# EAGLE design femto-beacon-esp32pico-d4-lps (EAGLE 9.3.0)

## Sheet 1 of 4
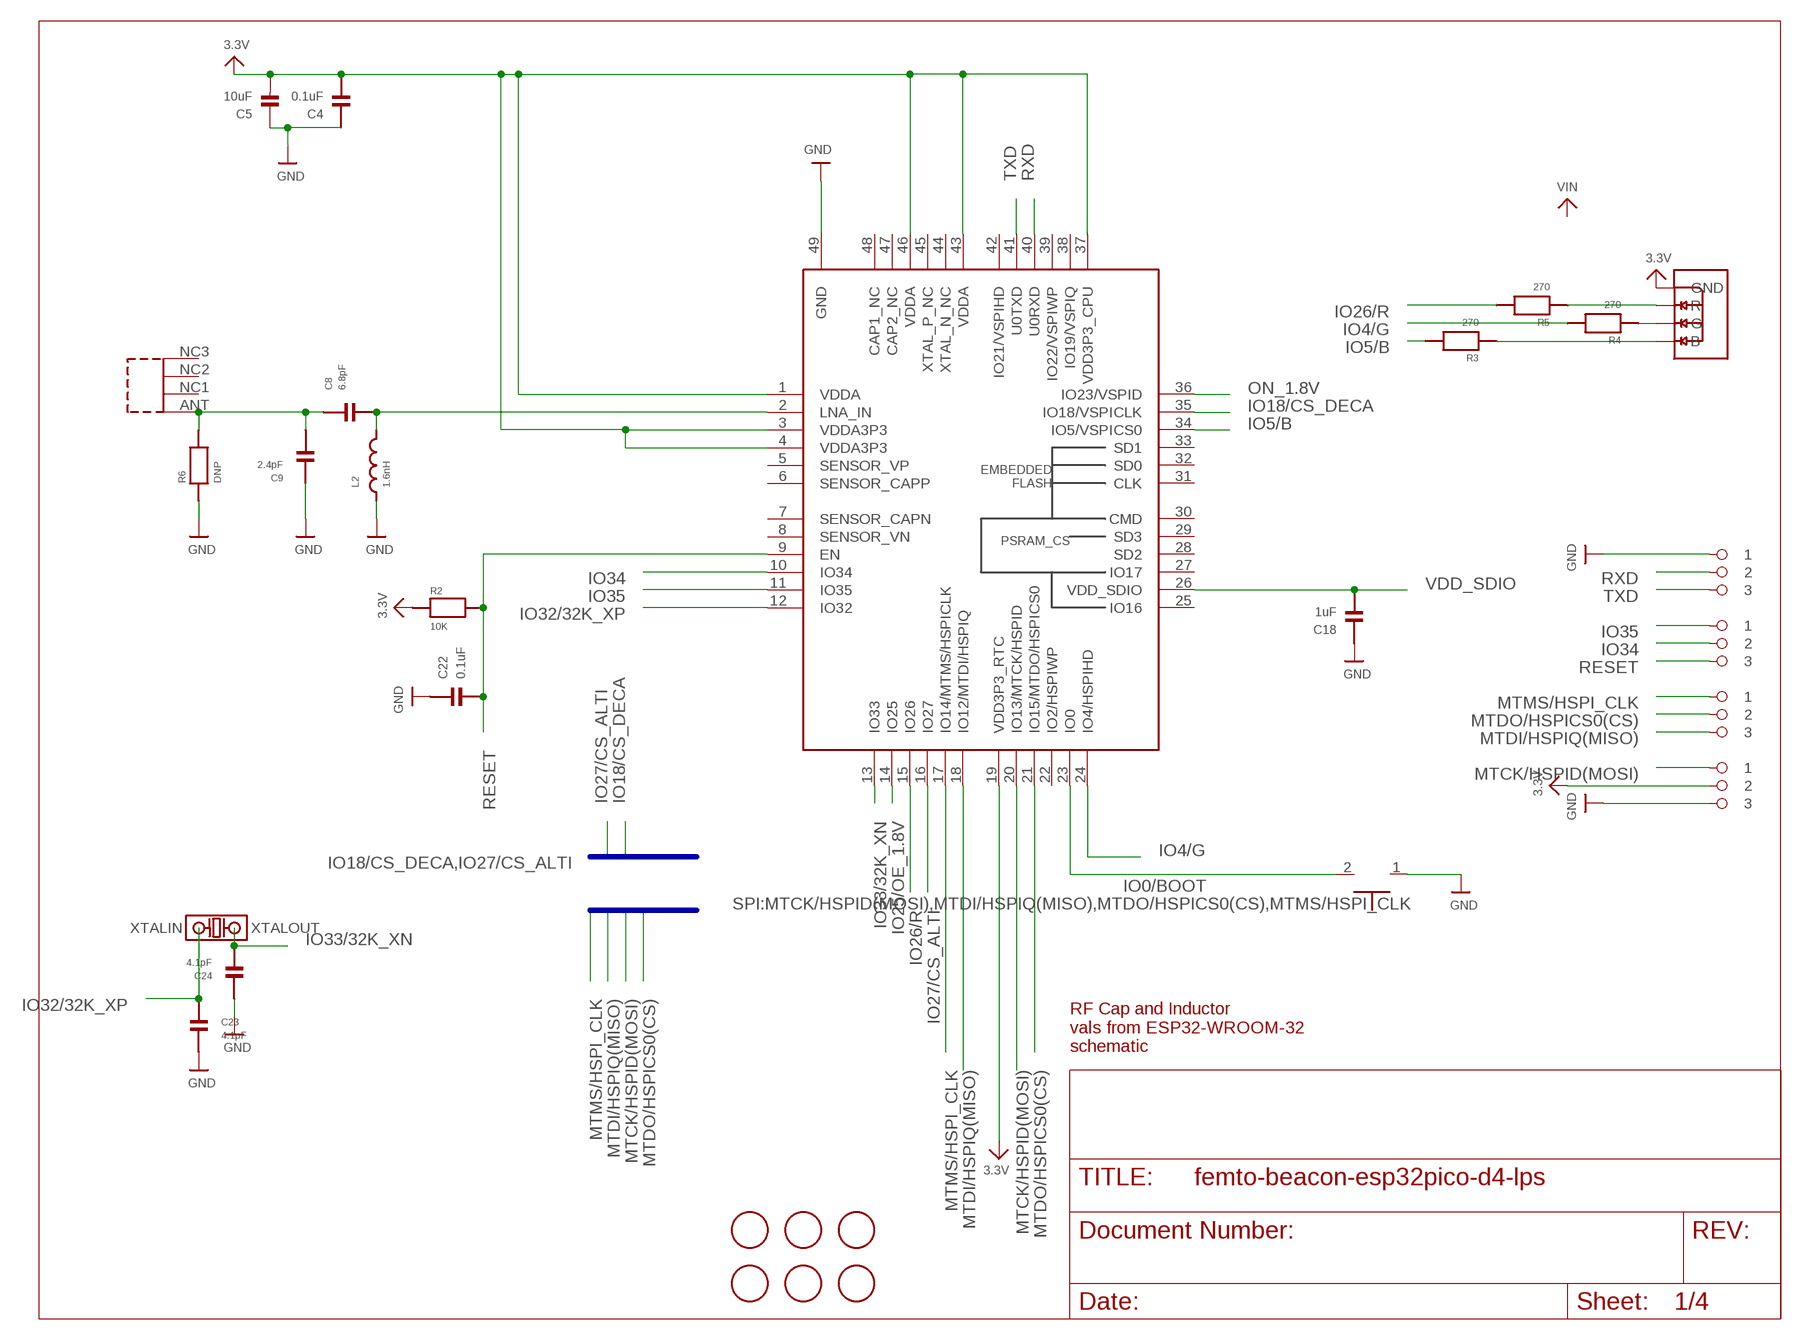
[diagram p0: schematic, sheet 1]

### Parts
ANT1  0479480001  [0479480001]
BOOT1  TACTILE_SWITCH_NO_GND_NO_BOSS  [SIDE_ACT_NO_GND_NO_BOSS]
C4  0.1uF  CAPACITOR_0201  [PART]
C5  10uF  CAP_CERAMIC_0603MP  [_0603MP]
C8  6.8pF  CAPACITOR_0201  [PART]
C9  2.4pF  CAPACITOR_0201  [PART]
C18  1uF  CAPACITOR_0201  [PART]
C22  0.1uF  CAPACITOR_0201  [PART]
C23  4.1pF  CAPACITOR_0201  [PART]
C24  4.1pF  CAPACITOR_0201  [PART]
FID1  FIDUCIAL  [FIDUCIAL_1MM]
FID2  FIDUCIAL  [FIDUCIAL_1MM]
FID3  FIDUCIAL  [FIDUCIAL_1MM]
FID4  FIDUCIAL  [FIDUCIAL_1MM]
FID5  FIDUCIAL  [FIDUCIAL_1MM]
FID6  FIDUCIAL  [FIDUCIAL_1MM]
IC1  ESP32-PICO-D4  [ESP32-QFN48_7X7]
L2  1.6nH  INDUCTOR_FIXED_0201  [PART]
PIN_EN  1X3_ROUND  [1X3_ROUND]
PIN_GPIO_A  1X3_ROUND  [1X3_ROUND]
PIN_GPIO_B  1X3_ROUND  [1X3_ROUND]
PIN_UART  1X3_ROUND  [1X3_ROUND]
R2  10K  RESISTOR_0201  [PART]
R3  270  RESISTOR_0201  [PART]
R4  270  RESISTOR_0201  [PART]
R5  270  RESISTOR_0201  [PART]
R6  DNP  RESISTOR_0201  [PART]
RGB1  LRTB_R48G  [LRTB_R48G]
XTAL2  ABS06-107-32.768KHZ-T  [ABS06-107-32.768KHZ-T]

### Nets
3.3V: C4.2 C5.2 IC1.1(VDDA) IC1.3(VDDA3P3) IC1.4(VDDA3P3) IC1.19(VDD3P3_RTC) IC1.37(VDD3P3_CPU) IC1.43(VDDA) IC1.46(VDDA) PIN_GPIO_A.P$2 R2.1 RGB1.1(GND) ; also sheet 2,3,4
ANT: C8.2 IC1.2(LNA_IN) L2.2
B_: R3.1 RGB1.4(B)
G_: R4.1 RGB1.3(G)
GND: BOOT1.1 C4.1 C5.1 C9.1 C18.1 C22.1 C23.1 C24.2 IC1.49(GND) L2.1 PIN_GPIO_A.P$3 PIN_UART.P$1 R6.1 ; also sheet 2,3,4
IO0/BOOT: BOOT1.2 IC1.23(IO0)
IO4/G: IC1.24(IO4/HSPIHD) R4.2
IO5/B: IC1.34(IO5/VSPICS0) R3.2
IO18/CS_DECA: IC1.35(IO18/VSPICLK) ; also sheet 3,4
IO25/OE_1.8V: IC1.14(IO25) ; also sheet 3
IO26/R: IC1.15(IO26) R5.2
IO27/CS_ALTI: IC1.16(IO27) ; also sheet 3,4
IO32/32K_XP: C23.2 IC1.12(IO32) XTAL2.1(XTALIN)
IO33/32K_XN: C24.1 IC1.13(IO33) XTAL2.2(XTALOUT)
IO34: IC1.10(IO34) PIN_EN.P$2
IO35: IC1.11(IO35) PIN_EN.P$1
MTCK/HSPID(MOSI): IC1.20(IO13/MTCK/HSPID) PIN_GPIO_A.P$1 ; also sheet 3,4
MTDI/HSPIQ(MISO): IC1.18(IO12/MTDI/HSPIQ) PIN_GPIO_B.P$3 ; also sheet 3,4
MTDO/HSPICS0(CS): IC1.21(IO15/MTDO/HSPICS0) PIN_GPIO_B.P$2 ; also sheet 3
MTMS/HSPI_CLK: IC1.17(IO14/MTMS/HSPICLK) PIN_GPIO_B.P$1 ; also sheet 3,4
N$6: ANT1.ANT C8.1 C9.2 R6.2
ON_1.8V: IC1.36(IO23/VSPID) ; also sheet 2
R_: R5.1 RGB1.2(R)
RESET: C22.2 IC1.9(EN) PIN_EN.P$3 R2.2
RXD: IC1.40(U0RXD) PIN_UART.P$2
TXD: IC1.41(U0TXD) PIN_UART.P$3
VDD_SDIO: C18.2 IC1.26(VDD_SDIO)
Unconnected: ANT1.NC1 ANT1.NC2 ANT1.NC3 IC1.5(SENSOR_VP) IC1.6(SENSOR_CAPP) IC1.7(SENSOR_CAPN) IC1.8(SENSOR_VN) IC1.22(IO2/HSPIWP) IC1.25(IO16) IC1.27(IO17) IC1.28(SD2) IC1.29(SD3) IC1.30(CMD) IC1.31(CLK) IC1.32(SD0) IC1.33(SD1) IC1.38(IO19/VSPIQ) IC1.39(IO22/VSPIWP) IC1.42(IO21/VSPIHD) IC1.44(XTAL_N_NC) IC1.45(XTAL_P_NC) IC1.47(CAP2_NC) IC1.48(CAP1_NC)

### Buses
SPI:MTCK/HSPID(MOSI),MTDI/HSPIQ(MISO),MTDO/HSPICS0(CS),MTMS/HSPI_CLK
IO18/CS_DECA,IO27/CS_ALTI

### Notes on the sheet
- RF Cap and Inductor
  vals from ESP32-WROOM-32
  schematic

## Sheet 2 of 4
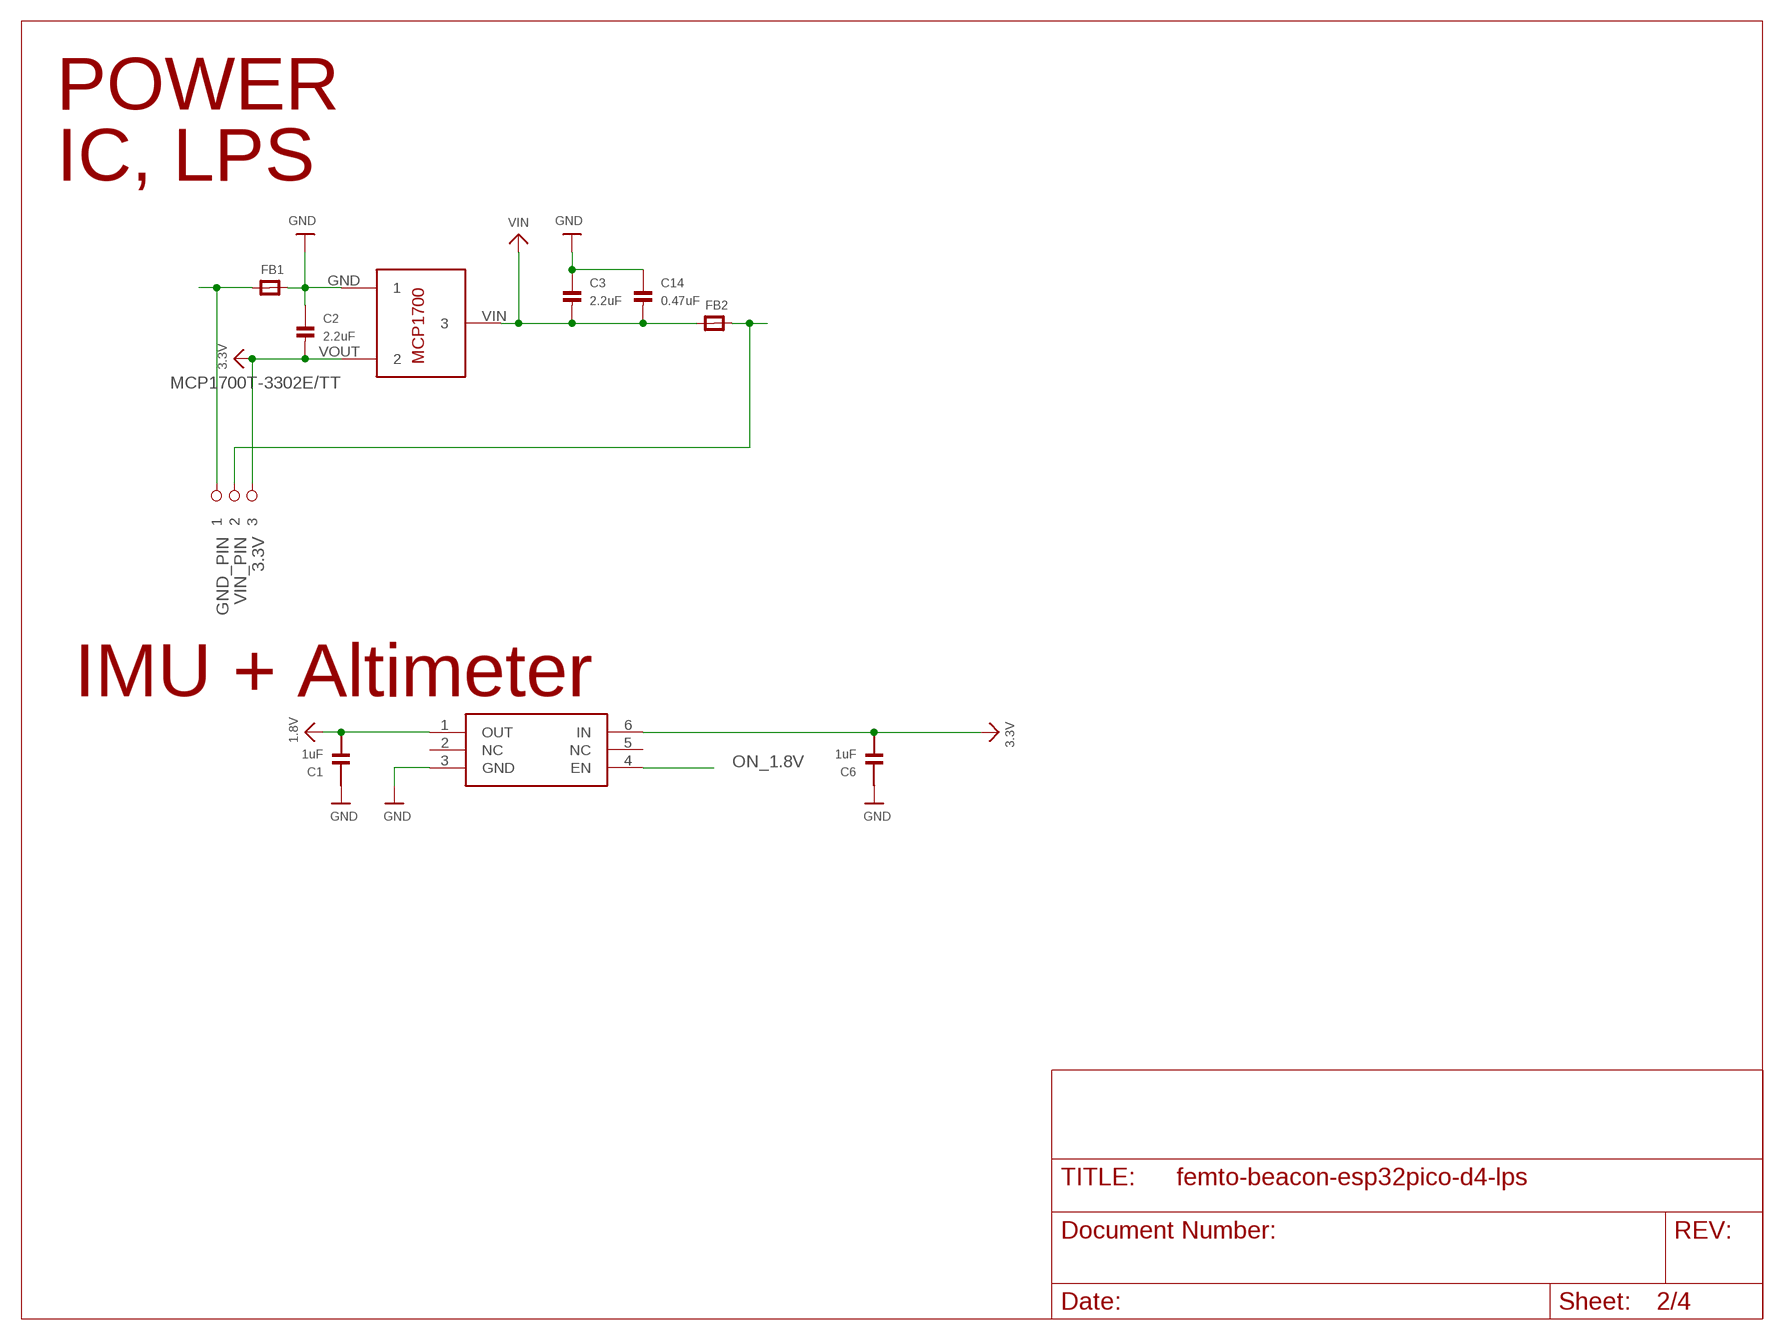
[diagram p1: schematic, sheet 2]

### Parts
C1  1uF  CAPACITOR_0201  [PART]
C2  2.2uF  CAP_CERAMIC_0402MP  [_0402MP]
C3  2.2uF  CAP_CERAMIC_0402MP  [_0402MP]
C6  1uF  CAPACITOR_0201  [PART]
C14  0.47uF  CAP_CERAMIC_0402MP  [_0402MP]
FB1  FERRITE_0603MP  [_0603MP]
FB2  FERRITE_0603MP  [_0603MP]
LDO1  MCP1700T-3302E/TT  [MCP1700T-3302E/TT]
LDO1.8V  NCP705MT18TCG  [CASE_511BR]
PIN_PWR  1X3_ROUND  [1X3_ROUND]

### Nets
1.8V: C1.2 LDO1.8V.1(OUT) ; also sheet 3
3.3V: C2.2 C6.2 LDO1.8V.6(IN) LDO1.VOUT PIN_PWR.P$3 ; also sheet 1,3,4
GND: C1.1 C2.1 C3.1 C6.1 C14.1 FB1.2 LDO1.8V.3(GND) LDO1.GND ; also sheet 1,3,4
GND_PIN: FB1.1 PIN_PWR.P$1
ON_1.8V: LDO1.8V.4(EN) ; also sheet 1
VIN: C3.2 C14.2 FB2.1 LDO1.VIN
VIN_PIN: FB2.2 PIN_PWR.P$2
Unconnected: LDO1.8V.2(NC) LDO1.8V.5(NC)

### Notes on the sheet
- POWER
- IC, LPS
- IMU + Altimeter

## Sheet 3 of 4
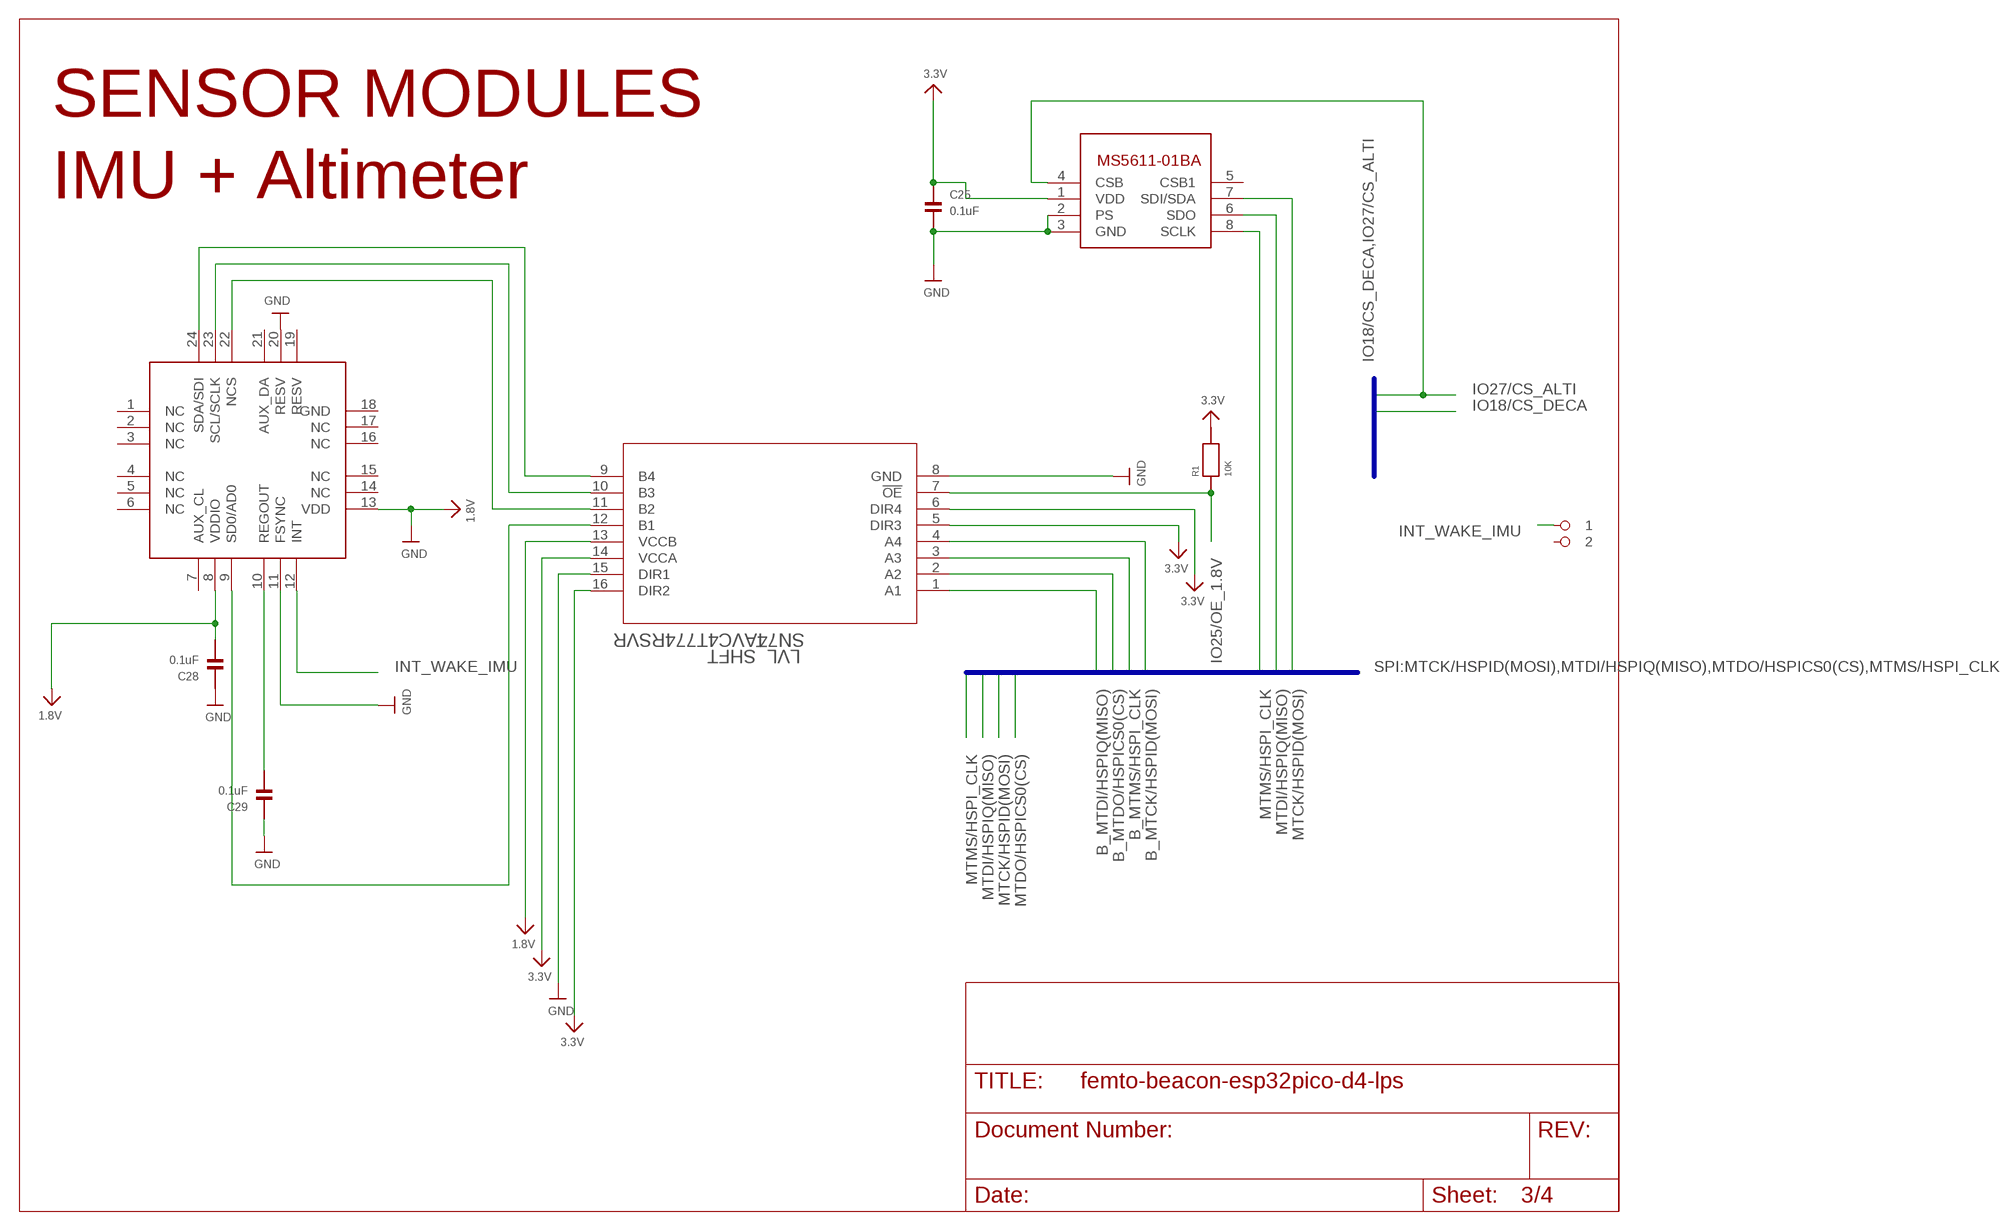
[diagram p2: schematic, sheet 3]

### Parts
ALT1  MS5611-01BA03  [MS5611-01BA03]
C25  0.1uF  CAPACITOR_0201  [PART]
C28  0.1uF  CAPACITOR_0201  [PART]
C29  0.1uF  CAPACITOR_0201  [PART]
IMU1  ICM-20948  [QFN24_3X3]
LVL_SHFT  SN74AVC4T774RSVR  [RSV16]
R1  10K  RESISTOR_0201  [PART]
U$1  1X2_ROUND  [1X2_ROUND]

### Nets
1.8V: C28.2 IMU1.8(VDDIO) IMU1.13(VDD) LVL_SHFT.13(VCCB) ; supply symbol labelled GND ; also sheet 2
3.3V: ALT1.1(VDD) C25.1 LVL_SHFT.5(DIR3) LVL_SHFT.6(DIR4) LVL_SHFT.14(VCCA) LVL_SHFT.16(DIR2) R1.2 ; also sheet 1,2,4
B_MTCK/HSPID(MOSI): IMU1.24(SDA/SDI) LVL_SHFT.9(B4)
B_MTDI/HSPIQ(MISO): IMU1.9(SD0/AD0) LVL_SHFT.12(B1)
B_MTDO/HSPICS0(CS): IMU1.22(NCS) LVL_SHFT.11(B2)
B_MTMS/HSPI_CLK: IMU1.23(SCL/SCLK) LVL_SHFT.10(B3)
GND: ALT1.2(PS) ALT1.3(GND) C25.2 C28.1 C29.1 IMU1.11(FSYNC) IMU1.20(RESV) LVL_SHFT.8(GND) LVL_SHFT.15(DIR1) ; also sheet 1,2,4
INT_WAKE_IMU: IMU1.12(INT) U$1.P$1
IO25/OE_1.8V: LVL_SHFT.7(!OE) R1.1 ; also sheet 1
IO27/CS_ALTI: ALT1.4(CSB) ; also sheet 1,4
MTCK/HSPID(MOSI): ALT1.7(SDI/SDA) LVL_SHFT.4(A4) ; also sheet 1,4
MTDI/HSPIQ(MISO): ALT1.6(SDO) LVL_SHFT.1(A1) ; also sheet 1,4
MTDO/HSPICS0(CS): LVL_SHFT.2(A2) ; also sheet 1
MTMS/HSPI_CLK: ALT1.8(SCLK) LVL_SHFT.3(A3) ; also sheet 1,4
N$16: C29.2 IMU1.10(REGOUT)
Unconnected: ALT1.5(CSB1) IMU1.1(NC) IMU1.2(NC) IMU1.3(NC) IMU1.4(NC) IMU1.5(NC) IMU1.6(NC) IMU1.7(AUX_CL) IMU1.14(NC) IMU1.15(NC) IMU1.16(NC) IMU1.17(NC) IMU1.19(RESV) IMU1.21(AUX_DA) U$1.P$2

### Buses
SPI:MTCK/HSPID(MOSI),MTDI/HSPIQ(MISO),MTDO/HSPICS0(CS),MTMS/HSPI_CLK
IO18/CS_DECA,IO27/CS_ALTI

### Notes on the sheet
- SENSOR MODULES
- IMU + Altimeter

## Sheet 4 of 4
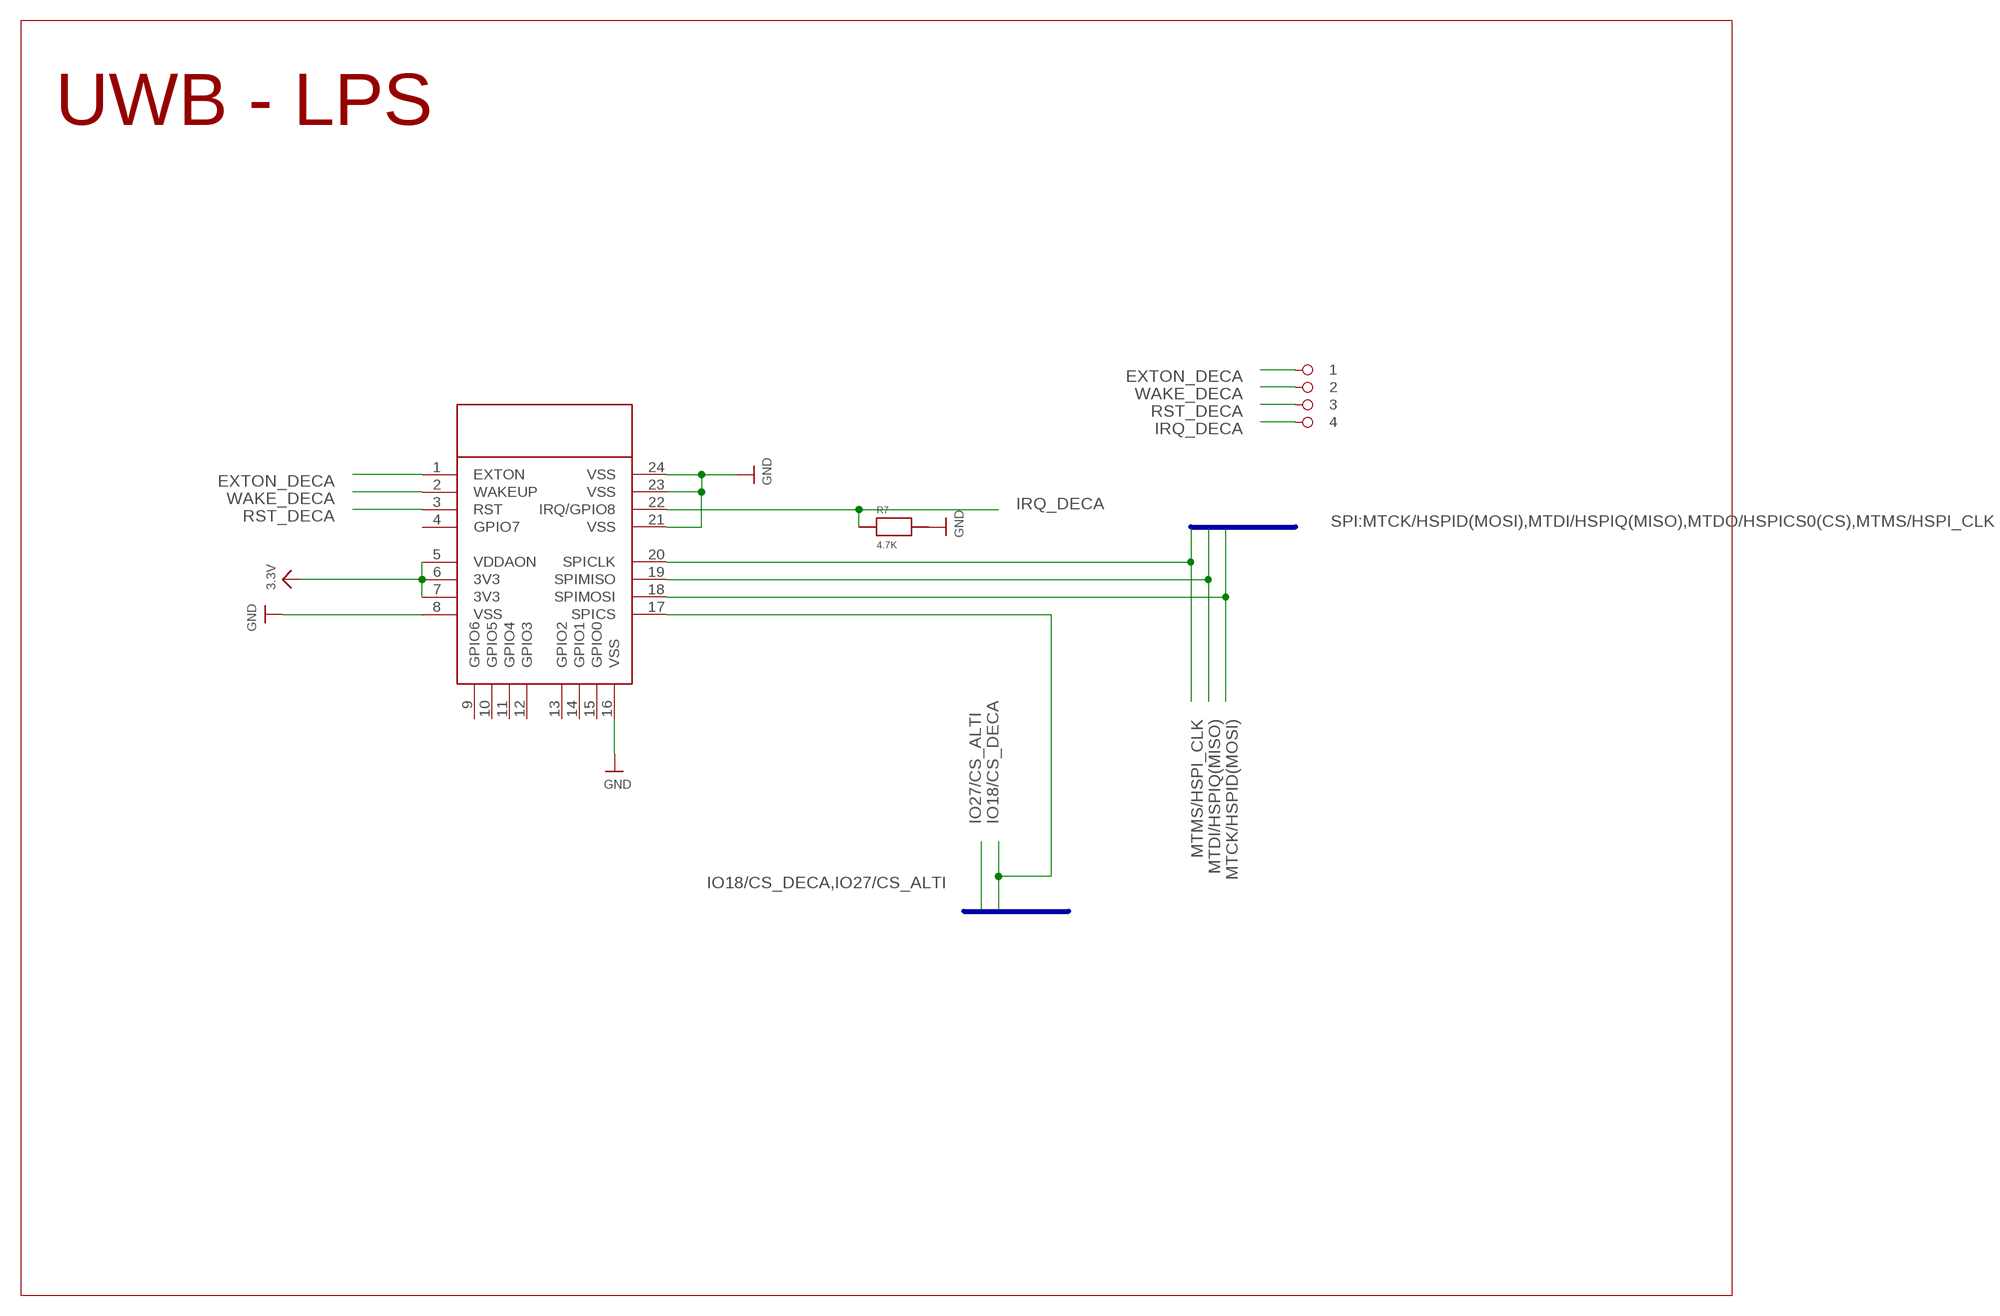
[diagram p3: schematic, sheet 4]

### Parts
LPS1  DWM100  [DWM100_MOD]
R7  4.7K  RESISTOR_0201  [PART]
U$39  1X4_ROUND  [1X4_ROUND]

### Nets
3.3V: LPS1.5(VDDAON) LPS1.6(3V3) LPS1.7(3V3) ; also sheet 1,2,3
EXTON_DECA: LPS1.1(EXTON) U$39.P$1
GND: LPS1.8(VSS) LPS1.16(VSS) LPS1.21(VSS) LPS1.23(VSS) LPS1.24(VSS) R7.2 ; also sheet 1,2,3
IO18/CS_DECA: LPS1.17(SPICS) ; also sheet 1,3
IRQ_DECA: LPS1.22(IRQ/GPIO8) R7.1 U$39.P$4
MTCK/HSPID(MOSI): LPS1.18(SPIMOSI) ; also sheet 1,3
MTDI/HSPIQ(MISO): LPS1.19(SPIMISO) ; also sheet 1,3
MTMS/HSPI_CLK: LPS1.20(SPICLK) ; also sheet 1,3
RST_DECA: LPS1.3(RST) U$39.P$3
WAKE_DECA: LPS1.2(WAKEUP) U$39.P$2
Unconnected: LPS1.4(GPIO7) LPS1.9(GPIO6) LPS1.10(GPIO5) LPS1.11(GPIO4) LPS1.12(GPIO3) LPS1.13(GPIO2) LPS1.14(GPIO1) LPS1.15(GPIO0)

### Buses
SPI:MTCK/HSPID(MOSI),MTDI/HSPIQ(MISO),MTDO/HSPICS0(CS),MTMS/HSPI_CLK
IO18/CS_DECA,IO27/CS_ALTI

### Notes on the sheet
- UWB - LPS

## Power pins joined to a net without a drawn wire
GND: IMU1.18(GND)

## Library data of the parts
ALT1 = freeimu:MS5611-01BA03; MPN: MS561101BA03-50
ANT1 = molex-antenna-2.4GHz:0479480001: Molex 2.4GHz SMD tower antenna.; MPN: 0479480001
BOOT1 = omron_tactile_switch:TACTILE_SWITCH_NO_GND_NO_BOSS: Omron tactile switch; MPN: B3U-3000P
C1 C6 C18 = parts_0201:CAPACITOR_0201; MPN: CL03A105KQ3CSNH
C2 C3 = microbuilder:CAP_CERAMIC: Ceramic Capacitors 0402 - 0402 Surface Mount Capacitors 16pF 50V 5% [Digikey: 445-4899-2-ND] 18pF 50V 5% [Digikey: 490-1281-2-ND] 22pF 50V 5% [Digikey: 490-1283-2-ND] 68pF 50V 5% [Digikey: 490-1289-2-ND] 0.1uF 10V 10% [Digikey: 490-1318-2-ND] 1.0uF 6.3V 10% [Digikey: 490-1320-2-ND] 0603 - 0603 Surface Mount Capacitors 16 pF 50V 5% [Digikey: 445-5051-2-ND] 22 pF 50V [Digikey: PCC220ACVTR-ND] 33 pF 50V 5% [Digikey: 490-1415-1-ND] 56pF 50V 5% [Digikey: 490-1421-1-ND] 220pF 50V 5% [Digikey: 445-1285-1-ND] 680 pF 50V 2200 pF 50V 5% C0G [Digikey: 445-1297-1-ND] 5600 pF 100V 5% X7R [Digikey: 478-3711-1-ND] 0.1 µF 25V 10% [Digikey: PCC2277TR-ND] 0.22 µF 16V 10% X7R [Digikey: 445-1318-1-ND] 1.0 µF 25V 10% [Digikey: 445-5146-2-ND] 0603 - RF Specific 3pF 250V +/-0.1pF RF [Digikey: 712-1347-1-ND] 18 pF 250V 5% [Digikey: 478-3505-1-ND or 712-1322-1-ND] 56 pF 250V 5% C0G RF [Digikey: 490-4867-1-ND] 68 pF 250V RF [Digikey: 490-4868-1-ND] 0805 - 0805 Surface Mount Capacitors 220 pF 250V 2% RF Ceramic Capacitor [Digikey: 712-1398-1-ND] 1000 pF 50V 2% NP0 Ceramic Capacitor [Digikey: 478-3760-1-ND] 0.1 µF 25V 10% Ceramic Capacitor [Digikey: PCC1828TR-ND] 1.0 µF 16V 10% Ceramic Capacitor[Digikey: 490-1691-2-ND] 10.0 µF 10V 10% Ceramic Capacitor[Digikey: 709-1228-1-ND] 10.0 uF 16V 10% Ceramic Capacitor [Digikey: 478-5165-2-ND] 47 uF 6.3V 20% Ceramic Capacitor [Digikey: 587-1779-1-ND or 399-5506-1-ND] 1206 - 1206 Surface Mount Capacitors 47uF 10V 20% Ceramic Capacitor [Digikey: 490-5528-1-ND or 399-5508-1-ND or 445-6010-1-ND] 100uF 6.3V -20%, +80% Y5V Ceramic Capacitor (Digikey: 490-4512-1-ND, Mouser: 81-GRM31CF50J107ZE1L); MPN: C1005X5R0J225K050BC
C4 C22 C25 C28 C29 = parts_0201:CAPACITOR_0201; MPN: GRM033C80J104KE84D
C5 = microbuilder:CAP_CERAMIC: Ceramic Capacitors 0402 - 0402 Surface Mount Capacitors 16pF 50V 5% [Digikey: 445-4899-2-ND] 18pF 50V 5% [Digikey: 490-1281-2-ND] 22pF 50V 5% [Digikey: 490-1283-2-ND] 68pF 50V 5% [Digikey: 490-1289-2-ND] 0.1uF 10V 10% [Digikey: 490-1318-2-ND] 1.0uF 6.3V 10% [Digikey: 490-1320-2-ND] 0603 - 0603 Surface Mount Capacitors 16 pF 50V 5% [Digikey: 445-5051-2-ND] 22 pF 50V [Digikey: PCC220ACVTR-ND] 33 pF 50V 5% [Digikey: 490-1415-1-ND] 56pF 50V 5% [Digikey: 490-1421-1-ND] 220pF 50V 5% [Digikey: 445-1285-1-ND] 680 pF 50V 2200 pF 50V 5% C0G [Digikey: 445-1297-1-ND] 5600 pF 100V 5% X7R [Digikey: 478-3711-1-ND] 0.1 µF 25V 10% [Digikey: PCC2277TR-ND] 0.22 µF 16V 10% X7R [Digikey: 445-1318-1-ND] 1.0 µF 25V 10% [Digikey: 445-5146-2-ND] 0603 - RF Specific 3pF 250V +/-0.1pF RF [Digikey: 712-1347-1-ND] 18 pF 250V 5% [Digikey: 478-3505-1-ND or 712-1322-1-ND] 56 pF 250V 5% C0G RF [Digikey: 490-4867-1-ND] 68 pF 250V RF [Digikey: 490-4868-1-ND] 0805 - 0805 Surface Mount Capacitors 220 pF 250V 2% RF Ceramic Capacitor [Digikey: 712-1398-1-ND] 1000 pF 50V 2% NP0 Ceramic Capacitor [Digikey: 478-3760-1-ND] 0.1 µF 25V 10% Ceramic Capacitor [Digikey: PCC1828TR-ND] 1.0 µF 16V 10% Ceramic Capacitor[Digikey: 490-1691-2-ND] 10.0 µF 10V 10% Ceramic Capacitor[Digikey: 709-1228-1-ND] 10.0 uF 16V 10% Ceramic Capacitor [Digikey: 478-5165-2-ND] 47 uF 6.3V 20% Ceramic Capacitor [Digikey: 587-1779-1-ND or 399-5506-1-ND] 1206 - 1206 Surface Mount Capacitors 47uF 10V 20% Ceramic Capacitor [Digikey: 490-5528-1-ND or 399-5508-1-ND or 445-6010-1-ND] 100uF 6.3V -20%, +80% Y5V Ceramic Capacitor (Digikey: 490-4512-1-ND, Mouser: 81-GRM31CF50J107ZE1L); MPN: GRM188R61C106KAALD
C8 = parts_0201:CAPACITOR_0201; MPN: GRM0335C2A6R8DA01D
C9 = parts_0201:CAPACITOR_0201; MPN: GRM0335C1H2R4CA01D
C14 = microbuilder:CAP_CERAMIC: Ceramic Capacitors 0402 - 0402 Surface Mount Capacitors 16pF 50V 5% [Digikey: 445-4899-2-ND] 18pF 50V 5% [Digikey: 490-1281-2-ND] 22pF 50V 5% [Digikey: 490-1283-2-ND] 68pF 50V 5% [Digikey: 490-1289-2-ND] 0.1uF 10V 10% [Digikey: 490-1318-2-ND] 1.0uF 6.3V 10% [Digikey: 490-1320-2-ND] 0603 - 0603 Surface Mount Capacitors 16 pF 50V 5% [Digikey: 445-5051-2-ND] 22 pF 50V [Digikey: PCC220ACVTR-ND] 33 pF 50V 5% [Digikey: 490-1415-1-ND] 56pF 50V 5% [Digikey: 490-1421-1-ND] 220pF 50V 5% [Digikey: 445-1285-1-ND] 680 pF 50V 2200 pF 50V 5% C0G [Digikey: 445-1297-1-ND] 5600 pF 100V 5% X7R [Digikey: 478-3711-1-ND] 0.1 µF 25V 10% [Digikey: PCC2277TR-ND] 0.22 µF 16V 10% X7R [Digikey: 445-1318-1-ND] 1.0 µF 25V 10% [Digikey: 445-5146-2-ND] 0603 - RF Specific 3pF 250V +/-0.1pF RF [Digikey: 712-1347-1-ND] 18 pF 250V 5% [Digikey: 478-3505-1-ND or 712-1322-1-ND] 56 pF 250V 5% C0G RF [Digikey: 490-4867-1-ND] 68 pF 250V RF [Digikey: 490-4868-1-ND] 0805 - 0805 Surface Mount Capacitors 220 pF 250V 2% RF Ceramic Capacitor [Digikey: 712-1398-1-ND] 1000 pF 50V 2% NP0 Ceramic Capacitor [Digikey: 478-3760-1-ND] 0.1 µF 25V 10% Ceramic Capacitor [Digikey: PCC1828TR-ND] 1.0 µF 16V 10% Ceramic Capacitor[Digikey: 490-1691-2-ND] 10.0 µF 10V 10% Ceramic Capacitor[Digikey: 709-1228-1-ND] 10.0 uF 16V 10% Ceramic Capacitor [Digikey: 478-5165-2-ND] 47 uF 6.3V 20% Ceramic Capacitor [Digikey: 587-1779-1-ND or 399-5506-1-ND] 1206 - 1206 Surface Mount Capacitors 47uF 10V 20% Ceramic Capacitor [Digikey: 490-5528-1-ND or 399-5508-1-ND or 445-6010-1-ND] 100uF 6.3V -20%, +80% Y5V Ceramic Capacitor (Digikey: 490-4512-1-ND, Mouser: 81-GRM31CF50J107ZE1L); MPN: GRM155R60J474KE19D
C23 C24 = parts_0201:CAPACITOR_0201; MPN: GRM0335C1H4R1BA01D
FB1 FB2 = microbuilder:FERRITE: Ferrite Bead 0603 MMZ1608B121C - 120 Ohm @ 100MHz, 600mA, 0.15 Ohm DC Resistance - Digikey: 445-2164-1-ND BK1608HW121-T - 120 Ohm, 600mA Ferrite Chip - Digikey: 587-1876-2-ND 0805 HZ0805B272R-10 - 2.7K Ohm @ 100MHz, 200mA, 0.8 Ohm DC Resistance - Digikey: 240-2504-1-ND (see also Murata BLM21BD272SN1L) MMZ2012Y152B - 1.5K Ohm @ 100MHz, 500mA, 0.4 Ohm DC Resistance - Digikey: 445-1560-1-ND - Mainly for high frequency (80-400MHz) MMZ2012R102A - 1K Ohm @ 100MHz, 500mA, 0.3 Ohm DC Resistance - Digikey: 445-1555-2-ND - More general purpose (10-200MHz); MPN: BLM18RK102SN1D
FID1-FID6 = adafruit:FIDUCIAL: For use by pick and place machines to calibrate the vision/machine, 1mm By microbuilder.eu
IC1 = esp32-wroom-32:ESP32-PICO-D4; MPN: ESP32-PICO-D4
IMU1 = icm-20948:ICM-20948; MPN: ICM-20948
L2 = parts_0201:INDUCTOR_FIXED_0201; MPN: LQP03HQ1N6B02D
LDO1 = MCP1700T-3302E_TT:MCP1700T-3302E/TT: Microchip LDO "MCP1700" in a 3-Pin SOT-23 package. ID: MCP1700T-3302E/TT; MPN: MCP1700T-3302E/TT
LDO1.8V = onsemi:NCP705MT18TCG: Fixed LDO regulator, 1.8V; MFN: NCP705MT18TCG; MPN: NCP705MT18TCG
LPS1 = decawave:DWM100; MPN: DWM1000
LVL_SHFT = til-level-shifter:SN74AVC4T774RSVR; MANUFACTURER_PART_NUMBER: SN74AVC4T774RSVR; MPN: SN74AVC4T774RSVR; VENDOR: Texas Instruments
PIN_EN PIN_GPIO_A PIN_GPIO_B PIN_PWR PIN_UART = pins_1.27mm_pitch:1X3_ROUND
R1 R2 = parts_0201:RESISTOR_0201; MPN: RC0201JR-0710KL
R3-R5 = parts_0201:RESISTOR_0201; MPN: RC0201FR-07270RL
R6 = parts_0201:RESISTOR_0201
R7 = parts_0201:RESISTOR_0201; MPN: RC0201FR-074K7L
RGB1 = osram_opto_LED:LRTB_R48G: OSRAM RGB LED; MPN: LRTB R48G
U$1 = pins_1.27mm_pitch:1X2_ROUND
U$39 = pins_1.27mm_pitch:1X4_ROUND
XTAL2 = crystals:ABS06-107-32.768KHZ-T: ABS06-107-32.768kHz-T Crystal Oscillator; MPN: ABS06-107-32.768kHz-T

## Board
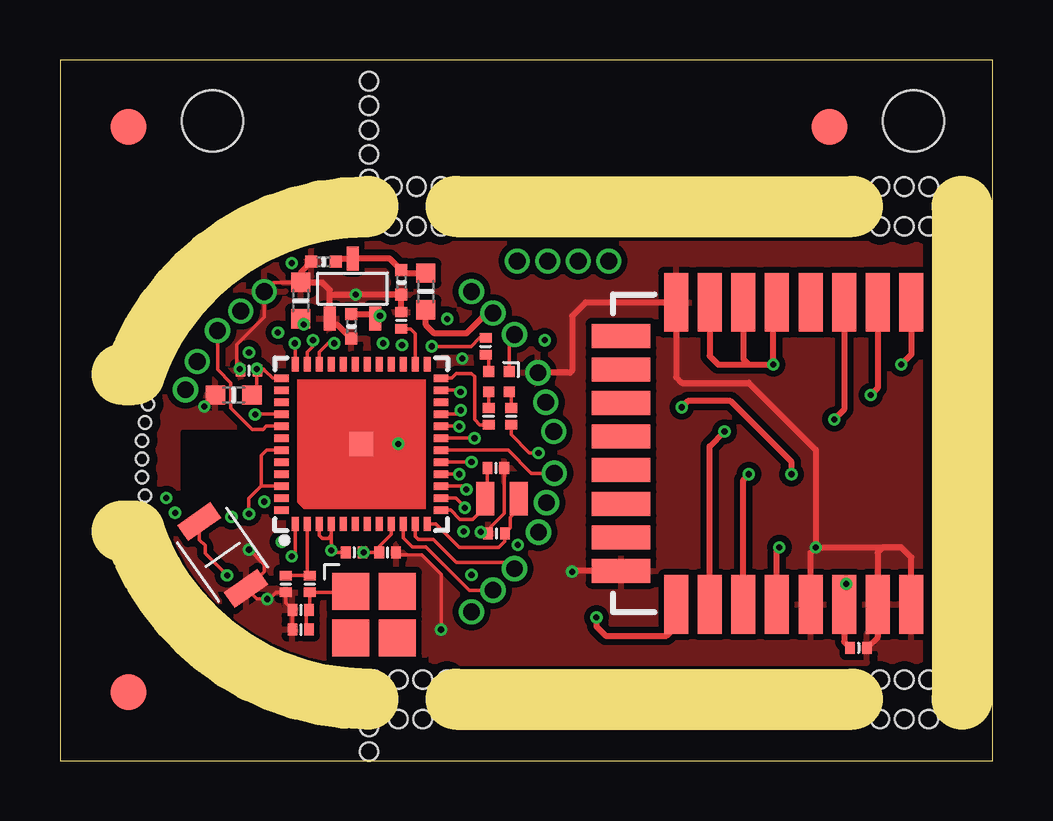
[diagram p4: board, top side]
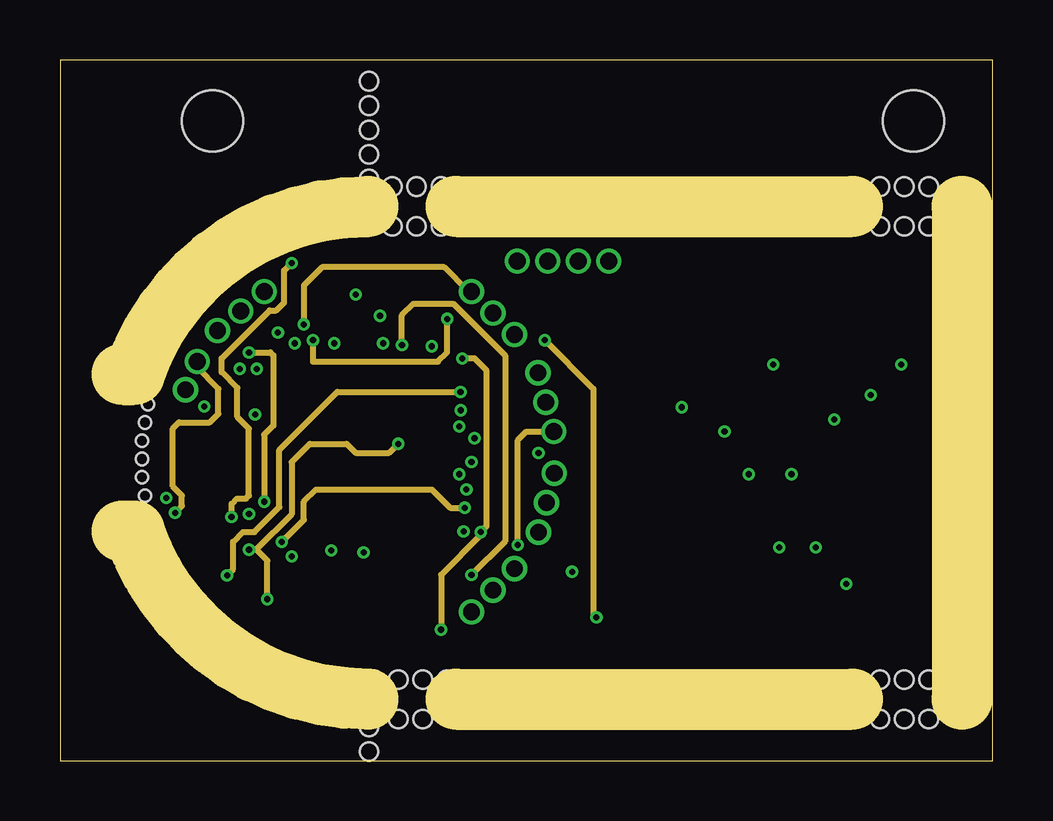
[diagram p5: board, inner layer Route2]
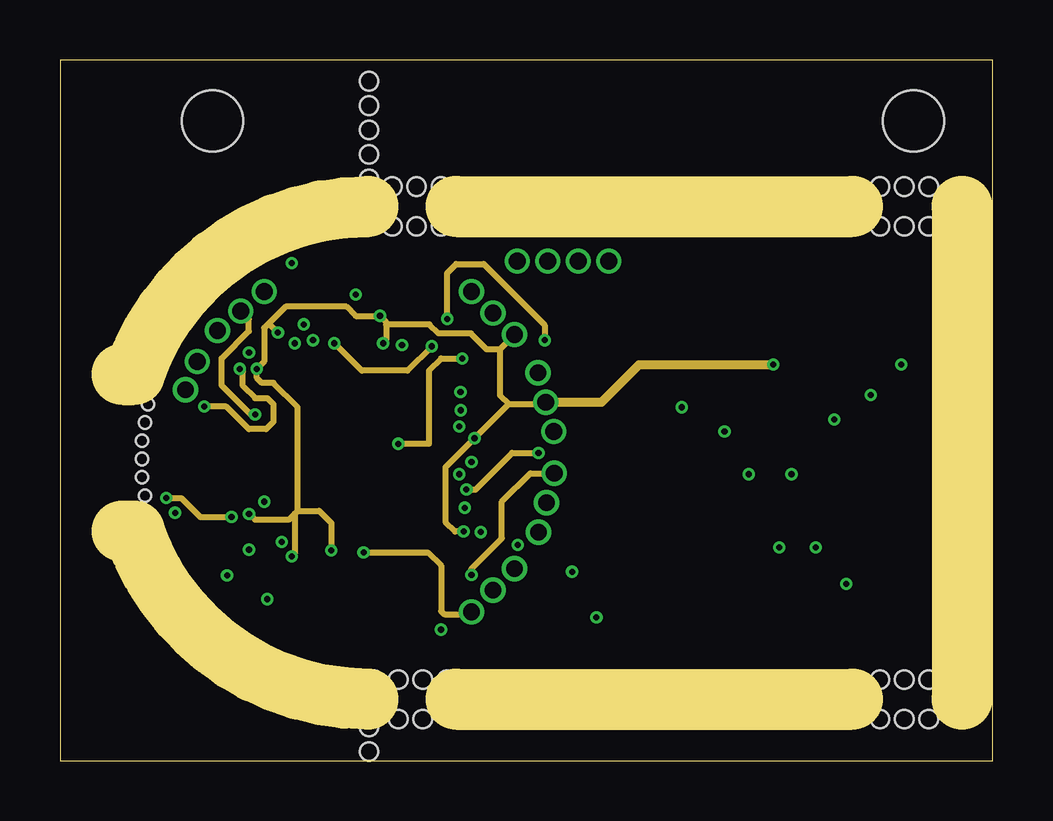
[diagram p6: board, inner layer Route15]
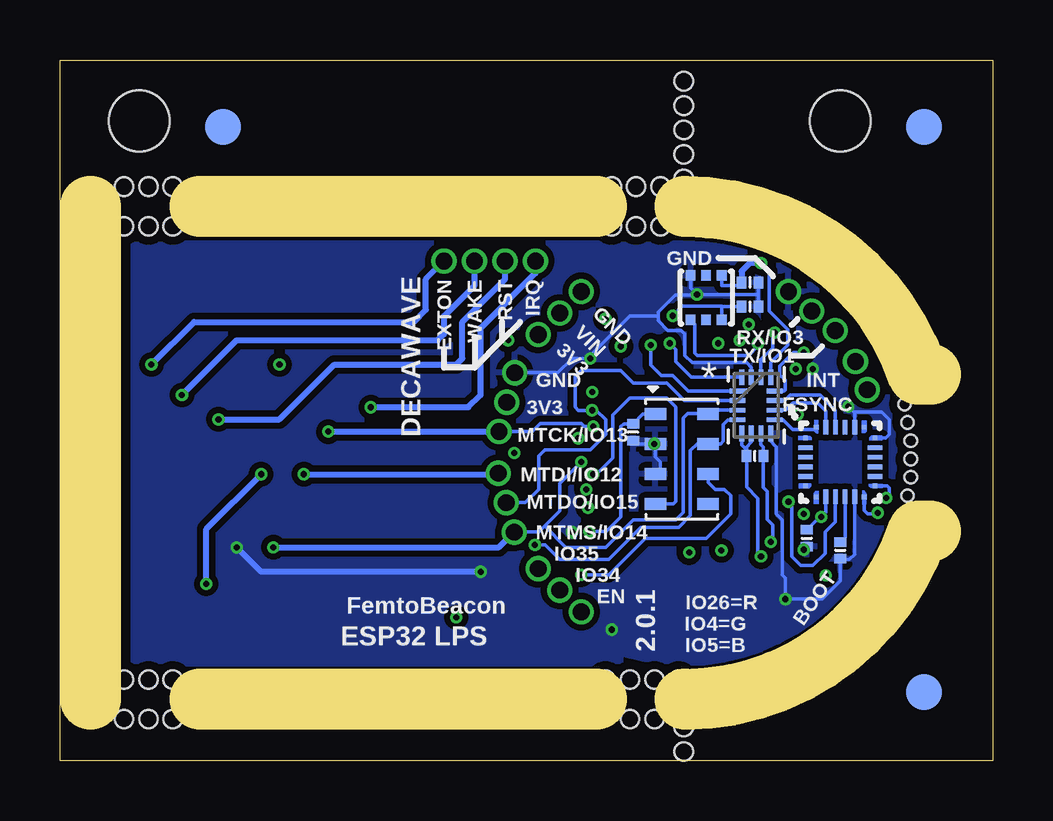
[diagram p7: board, bottom side, seen from below]

Size 38.86 x 29.21 mm. Coordinates in mm from the lower left corner, seen from the top.
Outline: 0,0 38.86,0 38.86,29.21 0,29.21 0,0
Copper layers (1*2*15*16): Top 0.035559375mm / dielectric 0.17018125mm / Route2 0.01778125mm / dielectric 47mil / Route15 0.01778125mm / dielectric 0.17018125mm / Bottom 0.035559375mm
Design rules "oshpark-4layer *": minimum track width 5mil, minimum drill 10mil, track to track 6mil, track to pad 6mil, pad to pad 6mil, via to via 6mil, smd to smd 5mil, copper to edge 15mil, drill to drill 6mil, minimum pad ring 4mil, minimum via ring 4mil, stop-mask expansion 2.5mil, vias tented up to drill 10mil, thermal gap 10mil
Holes 0.51 mm at 3.41,12.57 3.67,10.29 3.41,11.81 3.41,13.34 3.54,11.05 3.67,14.86 3.54,14.1
Holes 0.76 mm at 12.87,0.38 12.87,24.26 12.87,1.4 12.87,25.27 12.87,26.29 12.87,27.3 12.87,28.32 14.1,3.38 15.11,3.38 16.13,3.38 13.08,3.38 34.16,3.38 35.18,3.38 15.88,22.28 14.86,22.28 13.84,22.28 34.16,22.28 35.18,22.28 36.2,22.28 34.16,23.93 35.18,23.93 36.2,23.93 13.84,23.93 14.86,23.93 15.88,23.93 14.1,1.73 15.11,1.73 34.16,1.73 35.18,1.73 36.2,3.38 36.2,1.73
Holes 2.54 mm at 35.56,26.67 6.35,26.67
Milling: 7 lines

### Footprints (pad centres in the part's own frame; a part is rotated, then mirrored left to right if it is on the bottom)
MS5611-01BA03 = smd 0.9 x 0.5: 1 -1.1,1.875; 2 -1.1,0.625; 3 -1.1,-0.625; 4 -1.1,-1.875; 5 1.1,-1.875; 6 1.1,-0.625; 7 1.1,0.625; 8 1.1,1.875
0479480001 = smd 1.54 x 1.54: ANT -0.963,0.963; NC1 0.978,0.963; NC2 0.978,-0.978; NC3 -0.963,-0.978
SIDE_ACT_NO_GND_NO_BOSS = smd 0.8 x 1.7: 1 -1.7,0; 2 1.7,0
PART = smd 0.4 x 0.5: 1 -0.35,0; 2 0.35,0
_0402MP = smd 0.5 x 0.5: 1 -0.508,0; 2 0.508,0
_0603MP = smd 0.8 x 0.8: 1 -0.762,0; 2 0.762,0
FIDUCIAL_1MM = smd 1.5 x 1.5: 1 0,0
ESP32-QFN48_7X7 = smd 0.6 x 0.3: 1 -3.325,2.75; 2 -3.325,2.25; 3 -3.325,1.75; 4 -3.325,1.25; 5 -3.325,0.75; 6 -3.325,0.25; 7 -3.325,-0.25; 8 -3.325,-0.75; 9 -3.325,-1.25; 10 -3.325,-1.75; 11 -3.325,-2.25; 12 -3.325,-2.75; 25 3.325,-2.75; 26 3.325,-2.25; 27 3.325,-1.75; 28 3.325,-1.25; 29 3.325,-0.75; 30 3.325,-0.25; 31 3.325,0.25; 32 3.325,0.75; 33 3.325,1.25; 34 3.325,1.75; 35 3.325,2.25; 36 3.325,2.75 | smd 0.3 x 0.6: 13 -2.75,-3.325; 14 -2.25,-3.325; 15 -1.75,-3.325; 16 -1.25,-3.325; 17 -0.75,-3.325; 18 -0.25,-3.325; 19 0.25,-3.325; 20 0.75,-3.325; 21 1.25,-3.325; 22 1.75,-3.325; 23 2.25,-3.325; 24 2.75,-3.325; 37 2.75,3.325; 38 2.25,3.325; 39 1.75,3.325; 40 1.25,3.325; 41 0.75,3.325; 42 0.25,3.325; 43 -0.25,3.325; 44 -0.75,3.325; 45 -1.25,3.325; 46 -1.75,3.325; 47 -2.25,3.325; 48 -2.75,3.325 | smd 1 x 1: 49 0,0
QFN24_3X3 = smd 0.2 x 0.2: 1 -1.45,1; 6 -1.45,-1; 7 -1,-1.45; 12 1,-1.45; 13 1.45,-1; 18 1.45,1; 19 1,1.45; 24 -1,1.45 | smd 0.6 x 0.2: 2 -1.45,0.6; 3 -1.45,0.2; 4 -1.45,-0.2; 5 -1.45,-0.6; 14 1.45,-0.6; 15 1.45,-0.2; 16 1.45,0.2; 17 1.45,0.6 | smd 0.2 x 0.6: 8 -0.6,-1.45; 9 -0.2,-1.45; 10 0.2,-1.45; 11 0.6,-1.45; 20 0.6,1.45; 21 0.2,1.45; 22 -0.2,1.45; 23 -0.6,1.45
MCP1700T-3302E/TT = smd 0.5 x 1: GND -0.95,-1.25; VIN 0,1.25; VOUT 0.95,-1.25
CASE_511BR = smd 0.4 x 0.45: 1 -0.65,-0.925; 2 0,-0.925; 3 0.65,-0.925; 4 0.65,0.925; 5 0,0.925; 6 -0.65,0.925
DWM100_MOD = smd 2.45 x 1: 1 -6.295,0.8; 2 -6.295,-0.6; 3 -6.295,-2; 4 -6.295,-3.4; 5 -6.295,-4.8; 6 -6.295,-6.2; 7 -6.295,-7.6; 8 -6.295,-9; 17 6.295,-9; 18 6.295,-7.6; 19 6.295,-6.2; 20 6.295,-4.8; 21 6.295,-3.4; 22 6.295,-2; 23 6.295,-0.6; 24 6.295,0.8 | smd 1 x 2.45: 9 -4.9,-11.295; 10 -3.5,-11.295; 11 -2.1,-11.295; 12 -0.7,-11.295; 13 0.7,-11.295; 14 2.1,-11.295; 15 3.5,-11.295; 16 4.9,-11.295
RSV16 = smd 0.762 x 0.203: 1 -0.724,0.6 | smd 0.66 x 0.203: 2 -0.775,0.2; 3 -0.775,-0.2; 4 -0.775,-0.6; 9 0.775,-0.6; 10 0.775,-0.2; 11 0.775,0.2; 12 0.775,0.6 | smd 0.203 x 0.66: 5 -0.6,-1.175; 6 -0.2,-1.175; 7 0.2,-1.175; 8 0.6,-1.175; 13 0.6,1.175; 14 0.2,1.175; 15 -0.2,1.175; 16 -0.6,1.175
1X3_ROUND = drill 0.7 pad 1: P$1 0,0; P$2 0,-1.27; P$3 0,-2.54
LRTB_R48G = smd 0.45 x 0.45: 1 0.425,0.425; 2 0.425,-0.425; 3 -0.425,-0.425; 4 -0.425,0.425
1X2_ROUND = drill 0.7 pad 1: P$1 0,0; P$2 0,-1.27
1X4_ROUND = drill 0.7 pad 1: P$1 0,0; P$2 0,-1.27; P$3 0,-2.54; P$4 0,-3.81
ABS06-107-32.768KHZ-T = smd 0.75 x 1.4: 1 -0.7,0; 2 0.7,0

### Placement (x,y rotation side)
ALT1  12.95,12.57 0 bottom
ANT1  13.08,6.1 0 top
BOOT1  6.78,8.57 125 top
C1  10.11,19.94 180 bottom
C2  12.14,18.1 90 top
C3  10.99,20.8 0 top
C4  7.87,16.26 0 top
C5  7.24,15.24 0 top
C6  10.11,18.92 180 bottom
C8  10.41,7.37 90 top
C9  10.03,6.29 0 top
C14  14.22,19.94 90 top
C18  14.22,18.35 270 top
C22  13.65,8.67 180 top
C23  18.19,9.47 0 top
C24  18.16,12.19 0 top
C25  14.99,13.69 270 bottom
C28  7.75,9.27 90 bottom
C29  6.35,8.76 90 bottom
FB1  10.03,19.18 90 top
FB2  15.24,19.56 270 top
FID1  2.86,2.86 0 top
FID2  2.86,26.42 0 top
FID3  32.07,26.42 0 top
FID4  2.86,2.86 0 bottom
FID5  2.86,26.42 0 bottom
FID6  32.07,26.42 0 bottom
IC1  12.56,13.19 90 top
IMU1  6.35,12.45 0 bottom
L2  9.4,7.37 90 top
LDO1  12.19,19.68 0 top
LDO1.8V  11.94,19.3 180 bottom
LPS1  34.67,12.81 270 top
LVL_SHFT  9.86,14.81 0 bottom
PIN_EN  18.94,8 315 top
PIN_GPIO_A  20.57,13.72 195 top
PIN_GPIO_B  19.94,9.53 165 top
PIN_PWR  17.14,19.56 45 top
PIN_UART  8.51,19.56 310 top
R1  9.91,12.7 180 bottom
R2  12.26,8.67 0 top
R3  17.73,17.27 90 top
R4  17.86,14.35 270 top
R5  18.8,14.35 270 top
R6  10.03,5.46 0 top
R7  33.27,4.7 0 top
RGB1  18.29,15.8 0 top
U$1  5.71,16.64 337.5 top
U$39  22.86,20.83 270 top
XTAL2  18.41,10.92 180 top

### Tracks (layer width: path | path; a pad name or v marks a point on that pad's centre or on a via)
1.8V  (via drill 0.25 pad 0.51)
  Route2 0.254: v7.15,10.15 7.15,10.7 7.37,10.92 7.75,10.92 7.87,11.05 7.87,13.84 7.39,14.33 7.39,15.54 6.73,16.2 6.73,16.76 8.73,18.77 9.02,18.77 9.34,19.09 9.34,20.43 v9.65,20.75
  Route15 0.254: v4.43,10.94 5.06,10.94 5.85,10.15 v7.15,10.15
  Bottom 0.152: LDO1.8V.1 11.29,19.81 10.59,19.81 C1.2 | IMU1.13 4.39,11.45 4.3,11.36 4.3,11.07 v4.43,10.94 | IMU1.8 6.95,10.35 v7.15,10.15 7.21,10.15 C28.2 | LVL_SHFT.13 9.26,16.61 8.53,17.33 8.53,17.98 9.31,18.75 9.31,20.4 v9.65,20.75
  Bottom 0.254: v9.65,20.75 10.12,20.75 10.46,20.4 C1.2
3.3V  (via drill 0.25 pad 0.51)
  Top 0.152: IC1.3 10.81,9.39 10.92,9.27 11.18,9.27 11.3,9.4 | IC1.4 11.31,9.4 11.3,9.4 | IC1.1 9.81,8.66 v9.65,8.51 | 11.3,9.4 v11.3,8.76 11.39,8.67 R2.1 | IC1.46 8.39,11.44 | 8.39,11.44 7.87,10.92 v7.87,10.29 | IC1.43 8.62,12.94 8.39,12.71 8.39,11.44 | IC1.37 8.86,15.94 8.54,16.26 C4.2 8.22,16.13 8.21,16.13 8.49,16.33 v8.2,16.33 8.2,15.44 C5.2 | PIN_PWR.P$3 18.71,17.53 RGB1.1 | IC1.19 v17.27,13.44
  Top 0.254: C2.2 12.97,18.61 LDO1.VOUT 13.23,18.43 v13.34,18.54 | LPS1.5 29.72,18.95 v29.72,16.51 28.7,16.51 | LPS1.6 28.47,16.74 28.7,16.51 | LPS1.7 27.07,16.87 27.43,16.51 28.7,16.51
  Route15 0.254: 9.78,10.29 9.78,8.64 v9.65,8.51 | 9.78,10.29 9.53,10.03 8.13,10.03 v7.87,10.29 | 9.78,10.29 9.91,10.41 | 9.91,10.41 10.79,10.41 11.3,9.91 v11.3,8.76 | 9.91,10.41 9.91,14.73 8.89,15.75 8.41,15.75 8.2,15.95 v8.2,16.33 8.51,16.64 8.51,18.03 8.76,18.29 | PIN_PWR.P$3 18.32,17.14 | 18.32,17.14 17.78,17.14 17.12,17.8 15.77,17.8 15.39,18.19 13.61,18.19 13.59,18.16 | 18.69,14.86 v17.27,13.44 16.05,12.22 16.05,9.96 16.46,9.55 v16.82,9.55 | PIN_GPIO_A.P$2 20.16,14.86 18.69,14.86 | 18.32,17.14 18.32,15.22 18.69,14.86 | 8.76,18.29 9.4,18.92 11.94,18.92 12.32,18.54 v13.34,18.54 13.59,18.29 13.59,18.16 | v9.08,17.84 8.76,18.16 8.76,18.29 | 13.59,18.16 13.59,17.53 v13.46,17.4
  Route15 0.381: PIN_GPIO_A.P$2 22.56,14.94 24.13,16.51 v29.72,16.51
  Bottom 0.152: v16.82,9.55 16.1,9.55 15.49,10.16 15.49,13.92 15.37,14.04 C25.1 14.58,14.45 ALT1.1 | LDO1.8V.6 11.29,18.92 11.27,18.92 | 11.27,18.92 C6.2 | v13.34,18.54 12.93,18.95 11.3,18.95 11.27,18.92 | LVL_SHFT.6 10.05,13.28 10.26,13.08 10.26,12.95 | 10.26,12.95 R1.2 10.26,11.4 9.78,10.92 9.78,8.64 v9.65,8.51 | LVL_SHFT.5 10.46,13.15 10.26,12.95 | LVL_SHFT.14 9.65,16.71 9.17,17.2 9.17,17.75 v9.08,17.84 | LVL_SHFT.16 12.55,15.98 13.21,16.64 13.21,17.14 v13.46,17.4
ANT
  Top 0.152: IC1.2 10.31,7.82 C8.2 L2.2
B_
  Top 0.152: RGB1.4 17.86,16.79 R3.1
B_MTCK/HSPID(MOSI)
  Bottom 0.152: LVL_SHFT.9 8.72,14.21 8.33,13.81 7.43,13.81 IMU1.24
B_MTDI/HSPIQ(MISO)  (via drill 0.25 pad 0.51)
  Route2 0.254: v7.87,17.02 8.76,17.02 8.89,16.89 8.89,13.97 8.51,13.59 v8.51,10.79
  Bottom 0.152: IMU1.9 6.55,9.96 6.99,9.53 6.99,8.64 7.49,8.13 8,8.13 8.38,8.51 8.38,10.67 v8.51,10.79 | LVL_SHFT.12 8.69,15.41 8.65,15.44 8.65,15.87 8.87,16.08 8.87,16.46 8.3,17.02 v7.87,17.02
B_MTDO/HSPICS0(CS)
  Bottom 0.152: LVL_SHFT.11 8.66,15.01 8.43,15.24 7.19,15.24 6.55,14.6 IMU1.22
B_MTMS/HSPI_CLK
  Bottom 0.152: IMU1.23 6.95,14.57 7.29,14.91 8.33,14.91 8.63,14.61 LVL_SHFT.10
EXTON_DECA  (via drill 0.25 pad 0.51)
  Top 0.254: LPS1.1 35.47,16.93 v35.05,16.51
  Bottom 0.254: v35.05,16.51 33.27,18.29 24.13,18.29 23.62,18.8 23.62,20.07 U$39.P$1
G_
  Top 0.152: R4.1 RGB1.3
GND  (via drill 0.25 pad 0.51)
  Top 0.152: 13.99,13.32 12.68,13.32 IC1.49 | C5.1 6.01,14.78 v6.01,14.76 | C4.1 7.5,16.28 v7.49,16.33 7.37,16.46 7.37,17.35 8.51,18.49 PIN_UART.P$1 8.89,19.94 FB1.2 | BOOT1.1 7.78,7.15 | 7.78,7.15 8.2,6.73 v8.64,6.73 8.73,6.73 9.02,7.02 L2.1 9.4,6.57 C9.1 R6.1 | v7.88,8.79 8.51,8.16 8.51,7.87 7.78,7.15 | 11.3,18.37 LDO1.GND | C24.2 18.51,10.31 17.95,9.75 17.95,9.67 17.84,9.55 C23.1 17.78,9.53 v17.53,9.53 | v15.88,5.46 15.88,7.77 15.07,8.57 14.1,8.57 C22.1
  Top 0.254: LDO1.GND 11.24,19.43 | 11.24,19.43 11.24,19.62 10.92,19.94 FB1.2 10.03,20.36 C3.1 | C18.1 C14.1 v12.32,19.43 11.24,19.43 | LPS1.24 35.47,8.47 35.05,8.89 34.29,8.89 | 34.29,8.89 34.07,8.67 LPS1.23 34.07,5.15 R7.2 | LPS1.21 31.27,8.66 v31.5,8.89 | v31.5,8.89 34.29,8.89 | LPS1.16 21.37,7.91 v21.34,7.87 | PIN_GPIO_A.P$3 21.25,16.17 21.34,16.26 21.34,18.54 21.9,19.11 LPS1.8 25.67,15.98 25.91,15.75 28.7,15.75 31.5,12.95 v31.5,8.89 | C2.1 11.57,18.16 11.3,18.16 11.3,18.37 | v14.1,13.21 13.99,13.32
  Route2 0.254: 8.18,8.79 9.65,10.27 9.65,12.45 10.41,13.21 11.94,13.21 12.32,12.83 13.72,12.83 v14.1,13.21 | 8.18,8.79 v7.88,8.79 | v15.88,5.46 15.88,7.75 17.53,9.4 v17.53,9.53 17.78,9.78 17.78,16.26 17.27,16.76 v16.76,16.76 | v8.64,6.73 8.64,8.34 8.18,8.79
  Route15 0.254: v7.49,16.33 7.62,16.2 7.62,15.62 8.13,15.11 8.64,15.11 8.89,14.86 8.89,14.12 8.59,13.82 7.87,13.82 6.93,14.76 v6.01,14.76 | v16.76,16.76 15.88,16.76 15.37,16.26 15.37,13.21 v14.1,13.21
  Bottom 0.152: IMU1.18 4.46,13.45 4.32,13.59 4.32,14.22 4.63,14.53 5.79,14.53 | 5.79,14.53 5.75,14.49 IMU1.20 | 5.79,14.53 v6.01,14.76 | C28.1 v7.87,8.79 v7.88,8.79 | C29.1 6.35,8.38 | 6.35,8.38 6.35,7.49 7.11,6.73 v8.64,6.73 8.64,7.62 8.76,7.75 8.76,10.03 9.02,10.29 9.02,13.08 9.26,13.32 LVL_SHFT.8 | ALT1.3 13.84,12.16 13.84,12.45 14.05,12.66 ALT1.2 | PIN_GPIO_A.P$3 18.12,16.17 17.53,16.76 v16.76,16.76 16.76,16.89 15.11,18.54 13.95,18.54 | LDO1.8V.3 12.59,19.7 12.33,19.45 | 12.33,19.45 v12.32,19.43 9.76,19.43 | C1.1 9.76,19.43 | 9.76,19.43 C6.1 | IMU1.11 5.75,8.6 5.97,8.38 6.35,8.38 | 12.33,19.45 12.37,19.41 13.23,19.41 13.95,18.69 13.95,18.54 | LVL_SHFT.15 10.05,16.39 10.25,16.59 12.52,16.59 12.83,16.89 12.83,17.78 12.98,17.93 13.54,17.93 13.95,18.34 13.95,18.54 | C25.2 14.85,13.21 v14.1,13.21
  Bottom 0.254: v21.34,7.87 30.48,7.87 v31.5,8.89 | ALT1.2 14.06,13.21 v14.1,13.21
  pour Bottom (isolate 0.254): 4.06,12.81 arc-90 12.81,21.56 arc-90 21.56,12.81 arc-90 12.81,4.06 arc-90
  pour Top (isolate 0.254): 4.06,12.81 arc-90 12.81,21.56 arc-90 21.56,12.81 arc-90 12.81,4.06 arc-90
  cutout Top: 5.08,13.72 5.08,11.18 7.62,11.18 7.62,13.72
  pour Bottom (isolate 0.254): 12.95,21.56 35.81,21.56 35.81,4.06 15.49,4.06 15.49,8.38 12.95,8.38
  pour Top (isolate 0.254): 12.95,21.56 35.81,21.56 35.81,4.06 15.49,4.06 15.49,8.38 12.95,8.38
GND_PIN  (via drill 0.25 pad 0.51)
  Top 0.254: v10.16,18.19 10.03,18.31 FB1.1
  Route2 0.254: PIN_PWR.P$1 17.02,19.56 16,20.57 10.92,20.57 10.16,19.81 v10.16,18.19
INT_WAKE_IMU  (via drill 0.25 pad 0.51)
  Route2 0.254: v4.79,10.33 5.08,10.62 5.08,11.05 4.7,11.43 4.7,13.84 4.95,14.1 6.25,14.1 6.6,14.45 6.6,15.49 5.71,16.38 U$1.P$1
  Bottom 0.152: IMU1.12 5.35,10.43 5.21,10.29 4.84,10.29 v4.79,10.33
IO0/BOOT  (via drill 0.25 pad 0.51)
  Top 0.152: IC1.23 16.61,15.44 v16.69,15.37 | BOOT1.2 5.8,9.21 6.05,8.96 6.05,8.63 v6.96,7.72
  Route2 0.254: v16.69,15.37 11.56,15.37 9.14,12.95 9.14,10.57 8.1,9.53 7.62,9.53 7.21,9.12 7.21,7.98 v6.96,7.72
IO4/G
  Top 0.152: IC1.24 16.32,15.94 16.51,16.13 17.14,16.13 17.27,16 17.27,14.22 17.5,14 R4.2
IO5/B  (via drill 0.25 pad 0.51)
  Top 0.152: IC1.34 10.81,17.03 11.18,17.4 v11.43,17.4 | v15.49,17.27 17.12,17.27 17.48,17.62 R3.2
  Route15 0.254: v11.43,17.4 12.57,16.26 14.48,16.26 v15.49,17.27
IO18/CS_DECA  (via drill 0.25 pad 0.51)
  Top 0.152: IC1.35 10.31,17.04 10.54,17.27 v10.54,17.53
  Top 0.254: v22.35,5.97 22.35,5.59 22.73,5.21 25.27,5.21 25.67,5.61 LPS1.17
  Route2 0.254: v10.54,17.53 10.54,16.64 15.75,16.64 16.13,17.02 v16.13,18.41 | v20.19,17.53 22.23,15.49 22.23,6.1 v22.35,5.97
  Route15 0.254: v16.13,18.41 16.13,20.32 16.51,20.7 17.65,20.7 20.19,18.16 v20.19,17.53
IO25/OE_1.8V  (via drill 0.25 pad 0.51)
  Top 0.152: IC1.14 16.49,10.94 16.87,10.57 v16.87,10.54
  Route2 0.254: v9.25,9.12 10.16,10.03 10.16,10.79 10.67,11.3 15.49,11.3 16.26,10.54 v16.87,10.54
  Bottom 0.152: LVL_SHFT.7 9.65,13.18 9.56,13.08 R1.1 9.56,11.38 9.4,11.23 9.4,10.05 9.17,9.83 9.17,9.2 v9.25,9.12
IO26/R  (via drill 0.25 pad 0.51)
  Top 0.152: IC1.15 16.8,11.44 v16.93,11.3 | v19.94,12.83 19.56,12.83 18.8,13.59 R5.2
  Route15 0.254: v16.93,11.3 17.32,11.3 18.84,12.83 v19.94,12.83
IO27/CS_ALTI  (via drill 0.25 pad 0.51)
  Top 0.152: IC1.16 v16.63,11.94 v16.64,11.94
  Bottom 0.152: ALT1.4 13.3,10.7 13.21,10.79 13.21,14.73 13.59,15.11 15.11,15.11 15.82,14.4 15.82,12.62 16.51,11.94 v16.64,11.94
IO32/32K_XP
  Top 0.152: IC1.12 15.66,9.87 16.64,8.89 18.29,8.89 18.54,9.14 C23.2 18.77,9.7 18.77,10.13 19.11,10.48 XTAL2.1
IO33/32K_XN
  Top 0.152: C24.1 17.81,11.02 XTAL2.2 17.71,10.57 17.21,10.06 16.66,10.06 16.28,10.44 IC1.13
IO34
  Top 0.152: IC1.10 14.31,9.29 14.68,8.91 15.24,8.91 17.05,7.1 PIN_EN.P$2
IO35
  Top 0.152: IC1.11 14.81,9.35 14.94,9.22 15.54,9.22 16.51,8.26 18.69,8.26 PIN_EN.P$1
IRQ_DECA  (via drill 0.25 pad 0.51)
  Top 0.254: R7.1 32.67,4.95 LPS1.22 32.77,6.61 v32.77,7.37 | v30.48,11.94 30.48,12.45 27.94,14.99 26.16,14.99 v25.91,14.73
  Bottom 0.254: v32.77,7.37 32.77,9.65 v30.48,11.94 | v25.91,14.73 21.84,14.73 21.34,15.24 21.34,18.03 19.05,20.32 U$39.P$4
MTCK/HSPID(MOSI)  (via drill 0.25 pad 0.51)
  Top 0.152: IC1.20 16.62,13.94 v16.64,13.92
  Top 0.254: LPS1.18 27.07,13.1 v27.69,13.72
  Route2 0.254: v19.07,8.99 19.07,13.36 19.43,13.72 PIN_GPIO_A.P$1
  Bottom 0.152: v16.64,13.92 17.02,13.92 17.14,14.05 18.84,14.05 19.18,13.72 PIN_GPIO_A.P$1 | v19.07,8.99 18.64,8.99 18.03,8.38 16,8.38 14.66,9.73 13.08,9.73 12.6,10.21 12.6,12.93 12.32,13.21 12.31,13.2 ALT1.7 11.34,13.2 11.22,13.32 11.22,14.01 11.04,14.19 10.65,14.19 LVL_SHFT.4
  Bottom 0.254: v27.69,13.72 PIN_GPIO_A.P$1
MTDI/HSPIQ(MISO)  (via drill 0.25 pad 0.51)
  Top 0.152: IC1.18 18.68,12.94 19.64,11.98 PIN_GPIO_B.P$3
  Top 0.254: LPS1.19 28.47,11.71 v28.7,11.94
  Route2 0.254: v14.25,17.32 14.25,18.57 14.73,19.05 16.38,19.05 18.54,16.89 18.54,9.14 v17.14,7.75
  Route15 0.254: v17.14,7.75 17.14,8 18.41,9.27 18.41,10.79 19.6,11.98 PIN_GPIO_B.P$3
  Bottom 0.152: v17.14,7.75 16,7.75 14.48,9.27 11.94,9.27 10.92,10.29 10.92,11.05 11.18,11.3 11.56,11.3 11.85,11.6 ALT1.6 | LVL_SHFT.1 12.69,15.41 13.34,16.05 13.82,16.05 14.25,16.48 v14.25,17.32
  Bottom 0.254: v28.7,11.94 20.64,11.94 PIN_GPIO_B.P$3
MTDO/HSPICS0(CS)  (via drill 0.25 pad 0.51)
  Top 0.152: IC1.21 16.53,14.44 v16.69,14.61
  Bottom 0.152: PIN_GPIO_B.P$2 19.47,10.75 18.92,11.3 18.92,12.7 18.67,12.95 16.76,12.95 16.13,13.59 16.13,14.22 16.51,14.61 v16.69,14.61 17.27,14.61 17.4,14.73 17.4,16 17.14,16.26 15.49,16.26 14.99,15.75 13.59,15.75 12.85,15.01 LVL_SHFT.2
MTMS/HSPI_CLK  (via drill 0.25 pad 0.51)
  Top 0.152: IC1.17 v17.14,12.44 v17.14,12.45
  Top 0.254: LPS1.20 29.87,8.79 v29.97,8.89
  Bottom 0.152: v17.14,12.45 18.03,11.56 18.03,10.41 18.67,9.78 | 18.67,9.78 18.92,9.53 PIN_GPIO_B.P$1 | 18.67,9.78 17.78,8.89 16.13,8.89 14.99,10.03 13.21,10.03 12.9,10.34 12.9,14.28 12.7,14.48 11.88,14.48 ALT1.8 11.69,14.61 LVL_SHFT.3
  Bottom 0.254: PIN_GPIO_B.P$1 20.57,8.89 v29.97,8.89
N$6
  Top 0.152: ANT1.ANT 12.08,7.02 C8.1 10.41,6.32 C9.2 10.26,6.16 10.26,5.59 R6.2
N$16
  Bottom 0.152: IMU1.10 6.15,9.31 C29.2
ON_1.8V  (via drill 0.25 pad 0.51)
  Top 0.152: v9.78,17.4 9.81,17.37 IC1.36
  Bottom 0.152: v9.78,17.4 9.78,17.28 10.17,16.89 12.31,16.89 12.42,17 12.42,18.21 LDO1.8V.4
R_
  Top 0.152: R5.1 18.8,15.29 RGB1.2
RESET  (via drill 0.25 pad 0.51)
  Top 0.152: IC1.9 13.81,9.43 13.3,8.93 C22.2 v12.65,8.67 R2.2
  Route15 0.254: v12.65,8.67 15.33,8.67 15.88,8.13 15.88,6.22 16,6.1 17.04,6.1 PIN_EN.P$3
RST_DECA  (via drill 0.25 pad 0.51)
  Top 0.254: LPS1.3 32.67,14.64 v32.26,14.22
  Bottom 0.254: v32.26,14.22 29.72,14.22 27.43,16.51 22.35,16.51 22.1,16.76 22.1,18.29 20.32,20.07 U$39.P$3
RXD  (via drill 0.25 pad 0.51)
  Top 0.152: IC1.40 8.14,14.44 v8.13,14.42
  Route15 0.254: v8.13,14.42 7.95,14.42 6.73,15.64 6.73,16.76 7.87,17.91 7.87,18.4 PIN_UART.P$2
TXD
  Top 0.152: IC1.41 8.6,13.94 8.47,13.81 8.01,13.81 7.11,14.71 7.11,15.75 6.56,16.3 PIN_UART.P$3
VDD_SDIO
  Top 0.152: IC1.26 14.81,17.8 14.61,18 C18.2
VIN
  Top 0.254: C3.2 11.63,20.93 LDO1.VIN 13.74,20.93 C14.2 14.35,20.32 FB2.1
VIN_PIN
  Top 0.254: PIN_PWR.P$2 17.79,18.66 16.93,17.8 15.6,17.8 15.24,18.16 FB2.2
WAKE_DECA  (via drill 0.25 pad 0.51)
  Top 0.254: LPS1.2 34.07,15.53 v33.78,15.24
  Bottom 0.254: v33.78,15.24 31.5,17.53 23.11,17.53 22.86,17.78 22.86,18.54 21.59,19.81 U$39.P$2

### Text on the board
bPlace: GND | IRQ | RST | WAKE | EXTON | DECAWAVE | GND | RX/IO3 | VIN | TX/IO1 | 3V3 | INT | GND | FSYNC | 3V3 | MTCK/IO13 | MTDI/IO12 | MTDO/IO15 | MTMS/IO14 | IO35 | BOOT | IO34 | IO26=R | EN | IO4=G | 2.0.1 | FemtoBeacon | IO5=B | ESP32 LPS